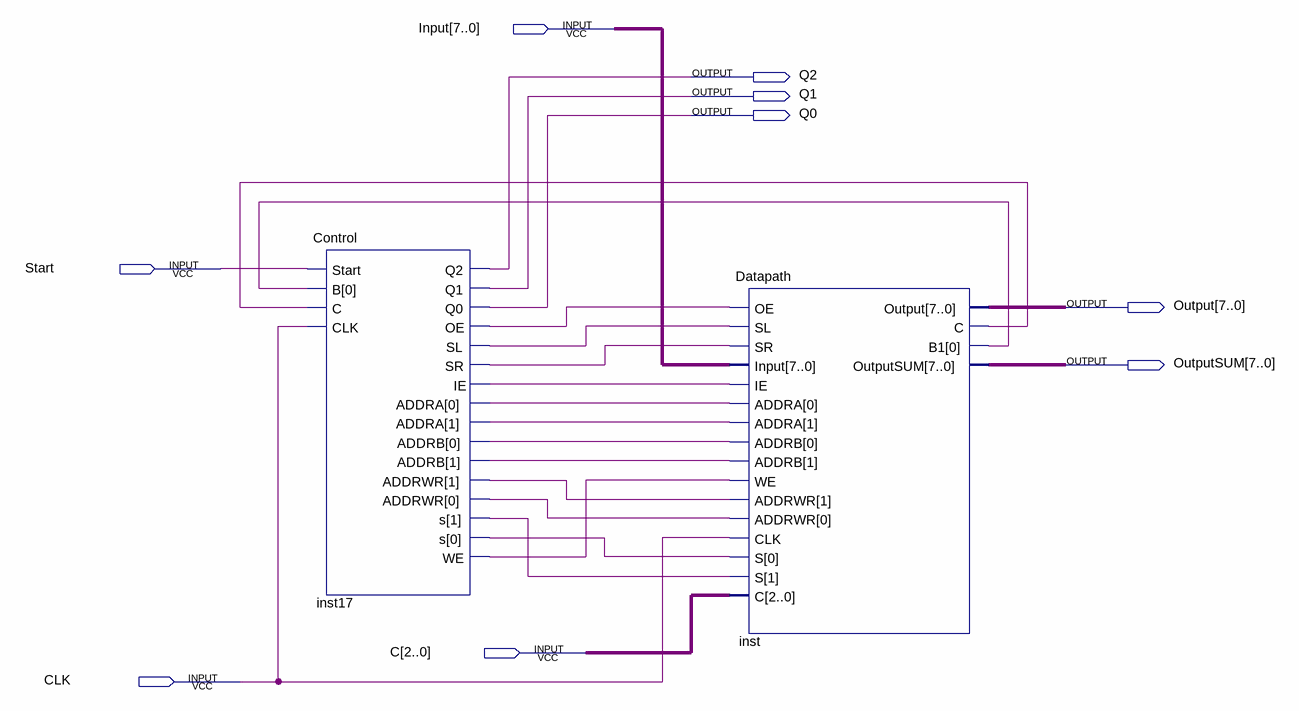
[diagram p0: schematic sheet]
// Quartus schematic MULTIPLY.bdf as structural Verilog: 2 symbols, 9 pins
module MULTIPLY (
  input  [7:0] Input,
  input  Start,
  input  [2:0] C,
  input  CLK,
  output Q2,
  output Q1,
  output Q0,
  output [7:0] Output,
  output [7:0] OutputSUM
);

  wire inst17_addra, inst17_addra_2, inst17_addrb, inst17_addrb_2, inst17_addrwr, inst17_addrwr_2, inst17_ie,
       inst17_oe, inst17_s, inst17_s_2, inst17_sl, inst17_sr, inst17_we, inst_b1, inst_c;

  Control inst17 (
    .Start(Start), .B(inst_b1), .C(inst_c), .CLK(CLK), .Q2(Q2), .Q1(Q1), .Q0(Q0), .OE(inst17_oe),
    .SL(inst17_sl), .SR(inst17_sr), .IE(inst17_ie), .ADDRA({inst17_addra_2, inst17_addra}),
    .ADDRB({inst17_addrb_2, inst17_addrb}), .ADDRWR({inst17_addrwr, inst17_addrwr_2}),
    .s({inst17_s, inst17_s_2}), .WE(inst17_we));
  Datapath inst (
    .OE(inst17_oe), .SL(inst17_sl), .SR(inst17_sr), .Input(Input), .IE(inst17_ie),
    .ADDRA({inst17_addra_2, inst17_addra}), .ADDRB({inst17_addrb_2, inst17_addrb}), .WE(inst17_we),
    .ADDRWR({inst17_addrwr, inst17_addrwr_2}), .CLK(CLK), .S({inst17_s, inst17_s_2}), .C({C, inst_c}),
    .Output(Output), .B1(inst_b1), .OutputSUM(OutputSUM));
endmodule
